# EAGLE schematic 4bit Arithmetic Unit (EAGLE 9.2.0)
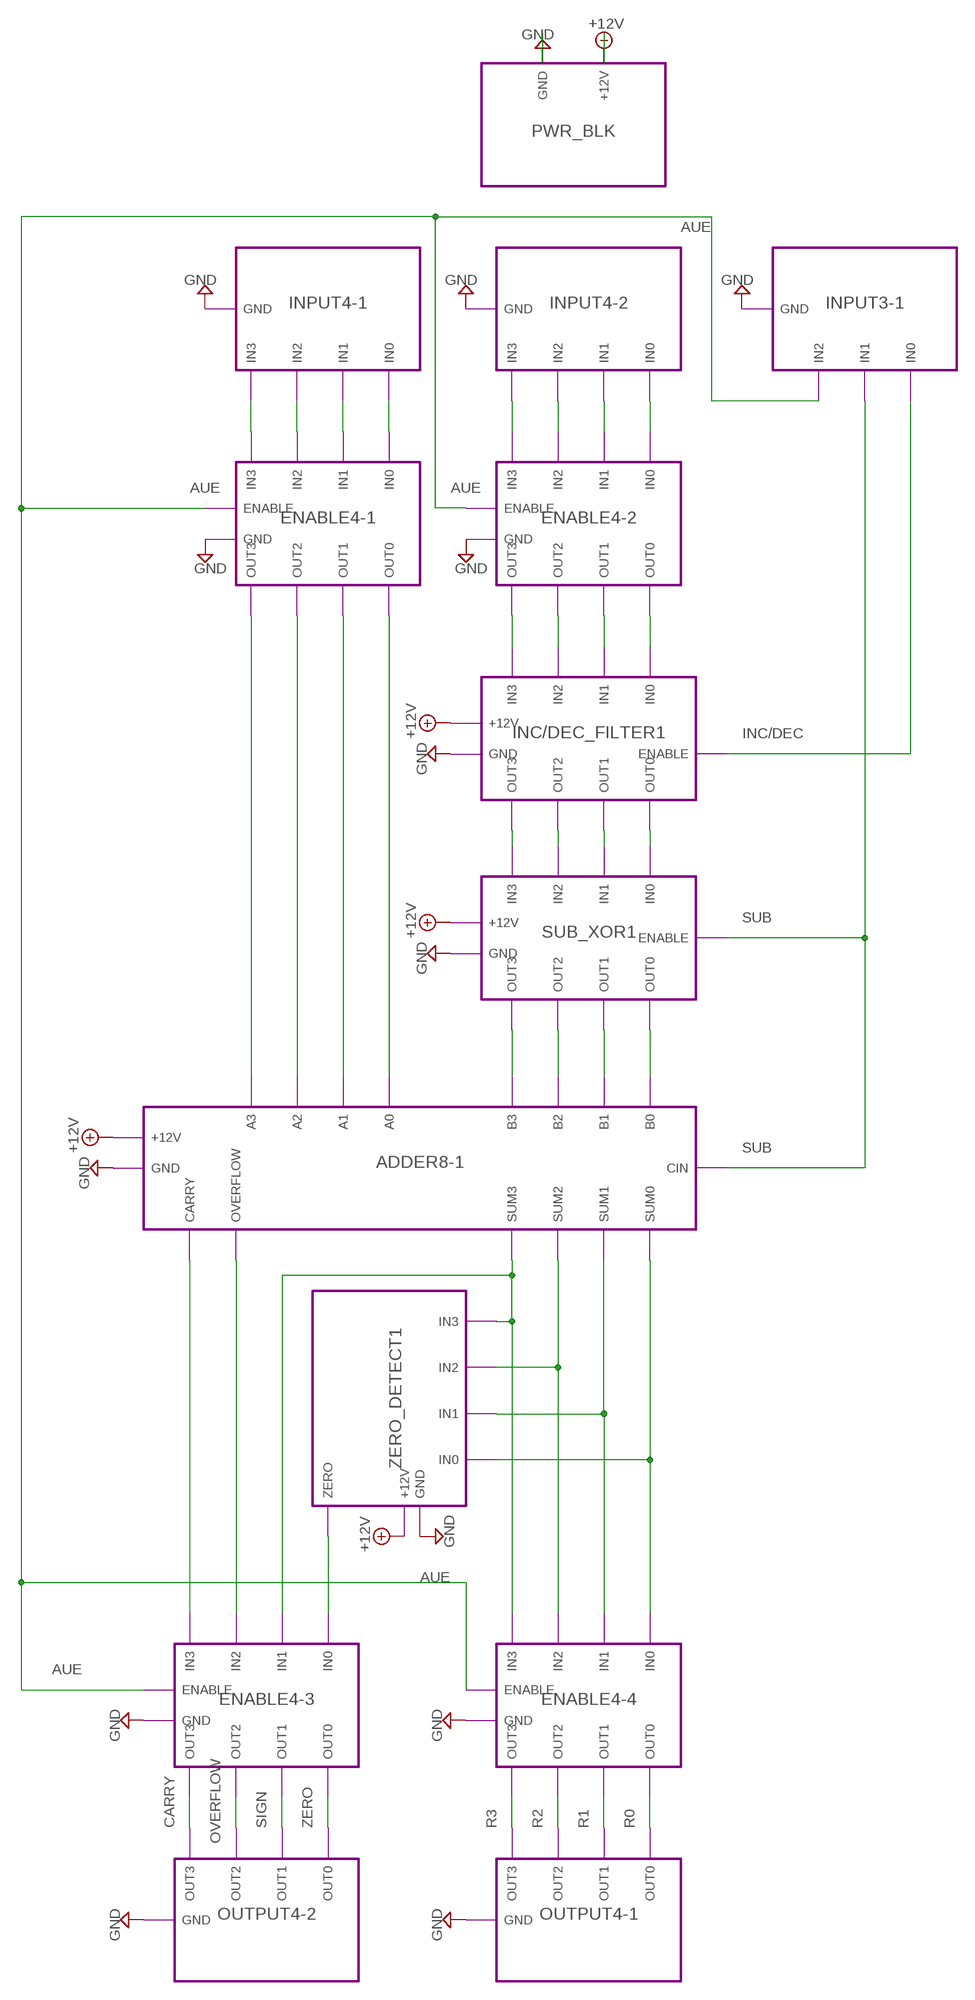
[diagram p0: schematic, sheet 1]

## Module instances
PWR_BLK = PWR_BLK
INPUT4-1 = INPUT4
INPUT4-2 = INPUT4
INPUT3-1 = INPUT3
ENABLE4-1 = ENABLE4
ENABLE4-2 = ENABLE4
INC/DEC_FILTER1 = INC/DEC_FILTER
SUB_XOR1 = SUB_XOR
ADDER8-1 = ADDER8
ZERO_DETECT1 = ZERO_DETECT
OUTPUT4-1 = OUTPUT4
OUTPUT4-2 = OUTPUT4
ENABLE4-3 = ENABLE4
ENABLE4-4 = ENABLE4

## Nets
+12V: port PWR_BLK.+12V INC/DEC_FILTER1.+12V SUB_XOR1.+12V ADDER8-1.+12V
AUE: port ENABLE4-2.ENABLE ENABLE4-1.ENABLE ENABLE4-3.ENABLE ENABLE4-4.ENABLE INPUT3-1.IN2
CARRY: port ENABLE4-3.OUT3 OUTPUT4-2.OUT3
GND: port PWR_BLK.GND INPUT4-1.GND INPUT4-2.GND INPUT3-1.GND ENABLE4-2.GND ENABLE4-1.GND INC/DEC_FILTER1.GND SUB_XOR1.GND ADDER8-1.GND OUTPUT4-1.GND OUTPUT4-2.GND ENABLE4-3.GND ENABLE4-4.GND
INC/DEC: port INC/DEC_FILTER1.ENABLE INPUT3-1.IN0
N$1: port INPUT4-1.IN0 ENABLE4-1.IN0
N$2: port INPUT4-1.IN1 ENABLE4-1.IN1
N$3: port INPUT4-1.IN2 ENABLE4-1.IN2
N$4: port INPUT4-1.IN3 ENABLE4-1.IN3
N$5: port INPUT4-2.IN0 ENABLE4-2.IN0
N$6: port INPUT4-2.IN1 ENABLE4-2.IN1
N$7: port INPUT4-2.IN2 ENABLE4-2.IN2
N$8: port INPUT4-2.IN3 ENABLE4-2.IN3
N$9: port ENABLE4-2.OUT3 INC/DEC_FILTER1.IN3
N$10: port ENABLE4-2.OUT2 INC/DEC_FILTER1.IN2
N$11: port ENABLE4-2.OUT1 INC/DEC_FILTER1.IN1
N$12: port ENABLE4-2.OUT0 INC/DEC_FILTER1.IN0
N$13: port ENABLE4-1.OUT0 ADDER8-1.A0
N$14: port ENABLE4-1.OUT1 ADDER8-1.A1
N$15: port ENABLE4-1.OUT2 ADDER8-1.A2
N$16: port ENABLE4-1.OUT3 ADDER8-1.A3
N$17: port INC/DEC_FILTER1.OUT0 SUB_XOR1.IN0
N$18: port INC/DEC_FILTER1.OUT1 SUB_XOR1.IN1
N$19: port INC/DEC_FILTER1.OUT2 SUB_XOR1.IN2
N$20: port INC/DEC_FILTER1.OUT3 SUB_XOR1.IN3
N$21: port SUB_XOR1.OUT3 ADDER8-1.B3
N$22: port SUB_XOR1.OUT2 ADDER8-1.B2
N$23: port SUB_XOR1.OUT1 ADDER8-1.B1
N$24: port SUB_XOR1.OUT0 ADDER8-1.B0
N$25: port ADDER8-1.CARRY ENABLE4-3.IN3
N$26: port ZERO_DETECT1.ZERO ENABLE4-3.IN0
N$40: port ADDER8-1.SUM0 ZERO_DETECT1.IN0 ENABLE4-4.IN0
N$41: port ZERO_DETECT1.IN1 ADDER8-1.SUM1 ENABLE4-4.IN1
N$42: port ADDER8-1.SUM2 ZERO_DETECT1.IN2 ENABLE4-4.IN2
N$43: port ADDER8-1.SUM3 ZERO_DETECT1.IN3 ENABLE4-3.IN1 ENABLE4-4.IN3
N$44: port ADDER8-1.OVERFLOW ENABLE4-3.IN2
OVERFLOW: port ENABLE4-3.OUT2 OUTPUT4-2.OUT2
R0: port ENABLE4-4.OUT0 OUTPUT4-1.OUT0
R1: port ENABLE4-4.OUT1 OUTPUT4-1.OUT1
R2: port ENABLE4-4.OUT2 OUTPUT4-1.OUT2
R3: port ENABLE4-4.OUT3 OUTPUT4-1.OUT3
SIGN: port ENABLE4-3.OUT1 OUTPUT4-2.OUT1
SUB: port SUB_XOR1.ENABLE ADDER8-1.CIN
ZERO: port ENABLE4-3.OUT0 OUTPUT4-2.OUT0

## Library data of the parts

## Module PWR_BLK
Ports: +12V(pwr) GND(pwr)
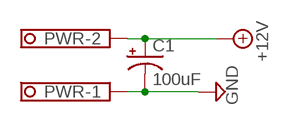
[diagram p1: schematic, module PWR_BLK, sheet 1]

### Parts
C1  100uF  100UF-POLAR-RADIAL-5MM-50V-20%  [CPOL-RADIAL-5MM-8MM]
PWR  PWR_BLK  [1751248]

### Nets
+12V: C1.1(+) PWR.2
GND: C1.2(-) PWR.1

### Library data of the parts
C1 = relay_computer_custom:100UF-POLAR: 100µF polarized capacitors A capacitor is a passive two-terminal electrical component used to store electrical energy temporarily in an electric field.; PROD_ID: ECA1HM101
PWR = relay_computer_custom:PWR_BLK: MKDS 1/ 2-3,5 Printklemme Nennstrom: 10 A Bemessungsspannung: 160 V Raster: 3,5 mm Polzahl: 2 Montageart: Löten Anschlussart: Schraubanschluss Anschlussrichtung vom Leiter zur Platine: 0° Source: http://eshop.phoenixcontact.com .. 1751248.pdf; OC_FARNELL: unknown; OC_NEWARK: unknown

## Module INPUT4
Ports: IN3(out) IN2(out) IN1(out) IN0(out) GND(pwr)
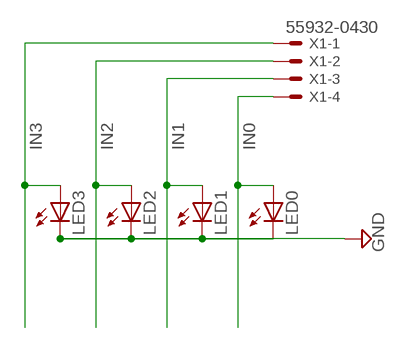
[diagram p2: schematic, module INPUT4, sheet 1]

### Parts
LED0  LED3MM  [LED3MM]
LED1  LED3MM  [LED3MM]
LED2  LED3MM  [LED3MM]
LED3  LED3MM  [LED3MM]
X1  55932-0430  [55932-0430]

### Nets
GND: LED0.K(C) LED1.K(C) LED2.K(C) LED3.K(C)
IN0: LED0.A X1.4
IN1: LED1.A X1.3
IN2: LED2.A X1.2
IN3: LED3.A X1.1

### Library data of the parts
LED0 LED1-LED3 = relay_computer_custom:LED: VCC 12V LED w/ built-in resistor
X1 = relay_computer_custom:55932-0430: 4 pin- 2.00mm Pitch MicroClasp™ Wire-to-Board Header, Single Row, Vertical, without PCB Locator Source: http://www.molex.com/pdm_docs/sd/559320430_sd.pdf

## Module INPUT3
Ports: IN0(out) IN1(out) IN2(out) GND(pwr)
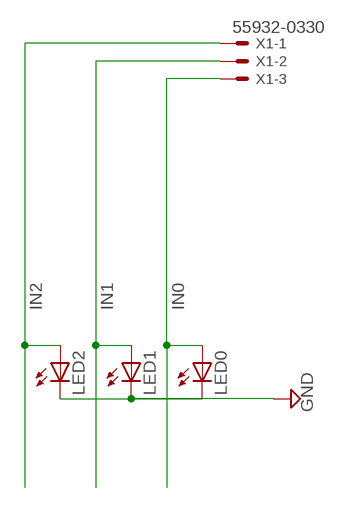
[diagram p3: schematic, module INPUT3, sheet 1]

### Parts
LED0  LED3MM  [LED3MM]
LED1  LED3MM  [LED3MM]
LED2  LED3MM  [LED3MM]
X1  55932-0330  [55932-0330]

### Nets
GND: LED0.K(C) LED1.K(C) LED2.K(C)
IN0: LED0.A X1.3
IN1: LED1.A X1.2
IN2: LED2.A X1.1

### Library data of the parts
LED0 LED1 LED2 = relay_computer_custom:LED: VCC 12V LED w/ built-in resistor
X1 = relay_computer_custom:55932-0330: 3 pin- 2.00mm Pitch MicroClasp™ Wire-to-Board Header, Single Row, Vertical, without PCB Locator Source: http://www.molex.com/pdm_docs/sd/559320330_sd.pdf

## Module ENABLE4
Ports: GND(pwr) ENABLE(in) OUT3(out) OUT2(out) OUT1(out) OUT0(out) IN3(in) IN2(in) IN1(in) IN0(in)
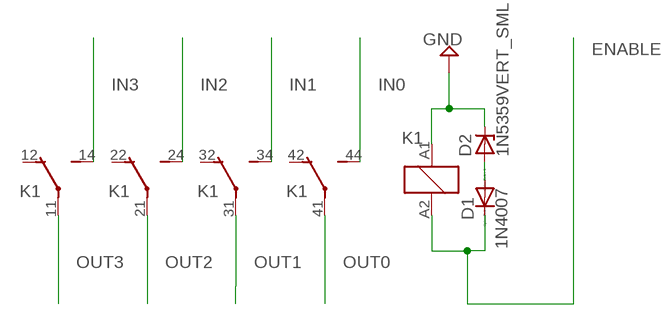
[diagram p4: schematic, module ENABLE4, sheet 1]

### Parts
D1  1N4007  [RAD2,5]
D2  1N5359VERT_SML  [RAD2.5_D2]
K1  PY14-02  [PY14-02]

### Nets
D$1: D1.A D2.A
ENABLE: D1.C K1.A2
GND: D2.C K1.A1
IN0: K1.44(5:S)
IN1: K1.34(4:S)
IN2: K1.24(3:S)
IN3: K1.14(2:S)
OUT0: K1.41(5:P)
OUT1: K1.31(4:P)
OUT2: K1.21(3:P)
OUT3: K1.11(2:P)
Unconnected: K1.12(2:O) K1.22(3:O) K1.32(4:O) K1.42(5:O)

### Library data of the parts
D1 = relay_computer_custom:1N4007: DIODE general purpose rectifier, 1 A
D2 = relay_computer_custom:1N5359: Z DIODE 24 V, 5W
K1 = relay_computer_custom:PY14-02: Miniature Relay OMRON 12VDC 4PDT 3A Relay Relay: MY4DC12 https://octopart.com/my4dc12-omron-13160135 Socket: PY14-02 https://octopart.com/py14-02-omron-113738

## Module INC/DEC_FILTER
Ports: GND(pwr) +12V(pwr) IN3(in) IN2(in) IN1(in) IN0(in) OUT0(out) OUT1(out) OUT2(out) OUT3(out) ENABLE(in)
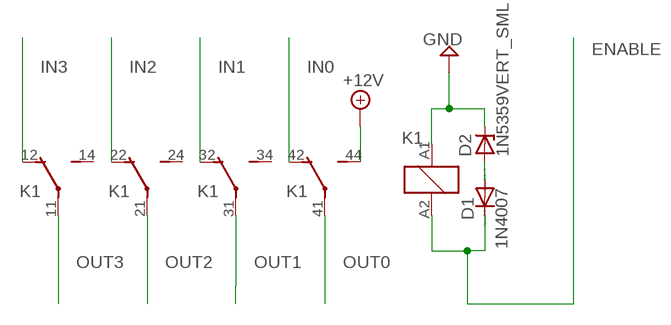
[diagram p5: schematic, module INC/DEC_FILTER, sheet 1]

### Parts
D1  1N4007  [RAD2,5]
D2  1N5359VERT_SML  [RAD2.5_D2]
K1  PY14-02  [PY14-02]

### Nets
+12V: K1.44(5:S)
D$1: D1.A D2.A
ENABLE: D1.C K1.A2
GND: D2.C K1.A1
IN0: K1.42(5:O)
IN1: K1.32(4:O)
IN2: K1.22(3:O)
IN3: K1.12(2:O)
OUT0: K1.41(5:P)
OUT1: K1.31(4:P)
OUT2: K1.21(3:P)
OUT3: K1.11(2:P)
Unconnected: K1.14(2:S) K1.24(3:S) K1.34(4:S)

### Library data of the parts
D1 = relay_computer_custom:1N4007: DIODE general purpose rectifier, 1 A
D2 = relay_computer_custom:1N5359: Z DIODE 24 V, 5W
K1 = relay_computer_custom:PY14-02: Miniature Relay OMRON 12VDC 4PDT 3A Relay Relay: MY4DC12 https://octopart.com/my4dc12-omron-13160135 Socket: PY14-02 https://octopart.com/py14-02-omron-113738

## Module SUB_XOR
Ports: +12V(pwr) GND(pwr) IN3(in) IN2(in) IN1(in) IN0(in) ENABLE(in) OUT0(out) OUT1(out) OUT2(out) OUT3(out)
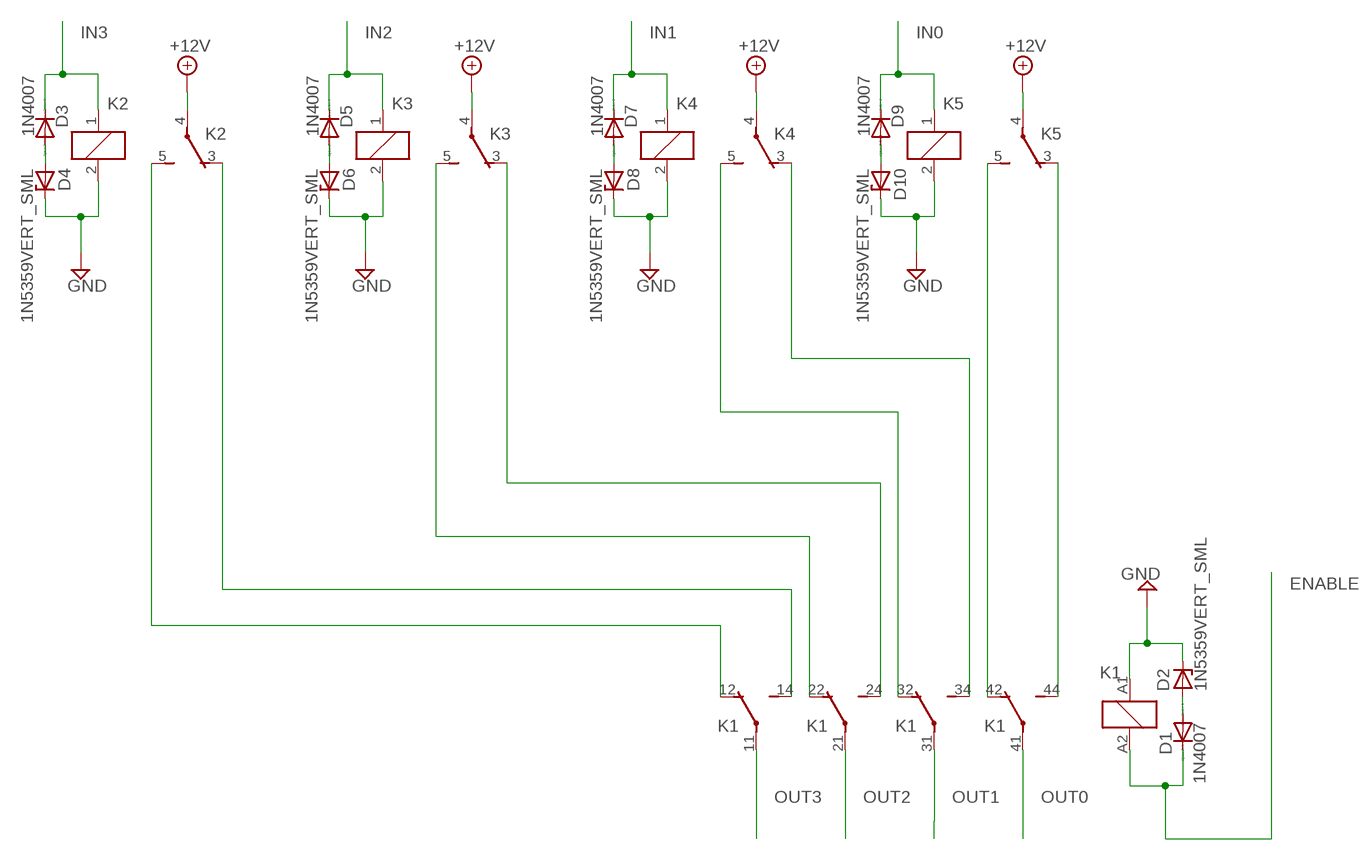
[diagram p6: schematic, module SUB_XOR, sheet 1]

### Parts
D1  1N4007  [RAD2,5]
D2  1N5359VERT_SML  [RAD2.5_D2]
D3  1N4007  [RAD2,5]
D4  1N5359VERT_SML  [RAD2.5_D2]
D5  1N4007  [RAD2,5]
D6  1N5359VERT_SML  [RAD2.5_D2]
D7  1N4007  [RAD2,5]
D8  1N5359VERT_SML  [RAD2.5_D2]
D9  1N4007  [RAD2,5]
D10  1N5359VERT_SML  [RAD2.5_D2]
K1  PY14-02  [PY14-02]
K2  HF41F-12-Z  [HF41F-12-Z]
K3  HF41F-12-Z  [HF41F-12-Z]
K4  HF41F-12-Z  [HF41F-12-Z]
K5  HF41F-12-Z  [HF41F-12-Z]

### Nets
+12V: K2.4(2:P) K3.4(2:P) K4.4(2:P) K5.4(2:P)
D$1: D1.A D2.A
D$2: D3.A D4.A
D$3: D5.A D6.A
D$4: D7.A D8.A
D$5: D9.A D10.A
ENABLE: D1.C K1.A2
GND: D2.C D4.C D6.C D8.C D10.C K1.A1 K2.2 K3.2 K4.2 K5.2
IN0: D9.C K5.1
IN1: D7.C K4.1
IN2: D5.C K3.1
IN3: D3.C K2.1
N$1: K1.42(5:O) K5.5(2:S)
N$2: K1.44(5:S) K5.3(2:O)
N$3: K1.34(4:S) K4.3(2:O)
N$4: K1.32(4:O) K4.5(2:S)
N$5: K1.24(3:S) K3.3(2:O)
N$6: K1.22(3:O) K3.5(2:S)
N$7: K1.14(2:S) K2.3(2:O)
N$8: K1.12(2:O) K2.5(2:S)
OUT0: K1.41(5:P)
OUT1: K1.31(4:P)
OUT2: K1.21(3:P)
OUT3: K1.11(2:P)

### Library data of the parts
D1 D3 D5 D7 D9 = relay_computer_custom:1N4007: DIODE general purpose rectifier, 1 A
D2 D4 D6 D8 D10 = relay_computer_custom:1N5359: Z DIODE 24 V, 5W
K1 = relay_computer_custom:PY14-02: Miniature Relay OMRON 12VDC 4PDT 3A Relay Relay: MY4DC12 https://octopart.com/my4dc12-omron-13160135 Socket: PY14-02 https://octopart.com/py14-02-omron-113738
K2-K5 = relay_computer_custom:HF41F-12-Z: SPDT RELAY Relay SPDT 5mm x 28mm HONGFA

## Module ADDER1
Ports: A(in) B(in) CIN(in) ~CIN(in) COUT(out) ~COUT(out) SUM(out) +12V(pwr) GND(pwr)
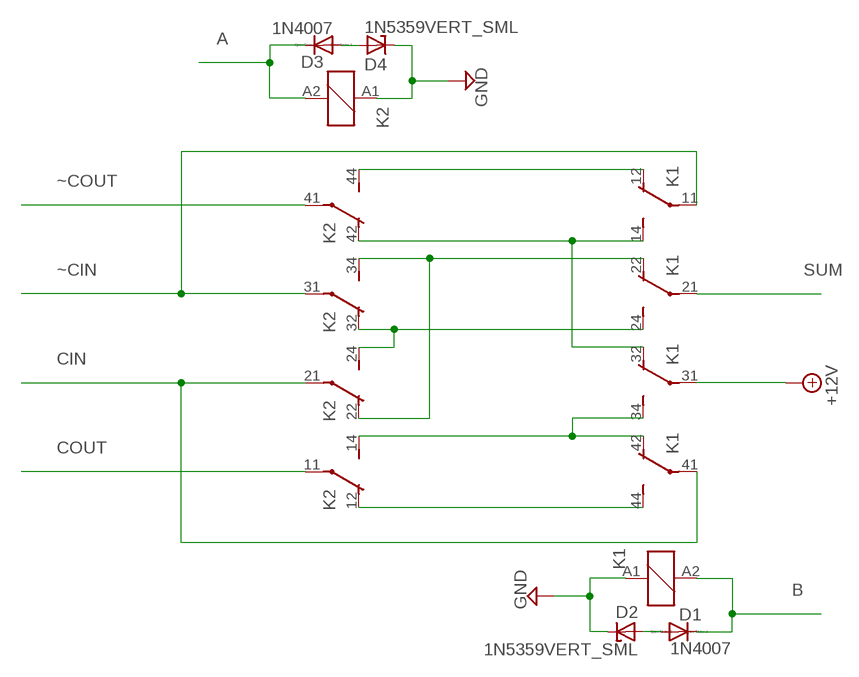
[diagram p7: schematic, module ADDER1, sheet 1]

### Parts
D1  1N4007  [RAD2,5]
D2  1N5359VERT_SML  [RAD2.5_D2]
D3  1N4007  [RAD2,5]
D4  1N5359VERT_SML  [RAD2.5_D2]
K1  PY14-02  [PY14-02]
K2  PY14-02  [PY14-02]

### Nets
+12V: K1.31(4:P)
A: D3.C K2.A2
B: D1.C K1.A2
CIN: K1.41(5:P) K2.21(3:P)
COUT: K2.11(2:P)
D$1: D1.A D2.A
D$2: D3.A D4.A
GND: D2.C D4.C K1.A1 K2.A1
N$1: K1.12(2:O) K2.44(5:S)
N$2: K1.14(2:S) K1.32(4:O) K2.42(5:O)
N$3: K1.22(3:O) K2.22(3:O) K2.34(4:S)
N$4: K1.24(3:S) K2.24(3:S) K2.32(4:O)
N$5: K1.44(5:S) K2.12(2:O)
N$6: K1.34(4:S) K1.42(5:O) K2.14(2:S)
SUM: K1.21(3:P)
~CIN: K1.11(2:P) K2.31(4:P)
~COUT: K2.41(5:P)

### Library data of the parts
D1 D3 = relay_computer_custom:1N4007: DIODE general purpose rectifier, 1 A
D2 D4 = relay_computer_custom:1N5359: Z DIODE 24 V, 5W
K1 K2 = relay_computer_custom:PY14-02: Miniature Relay OMRON 12VDC 4PDT 3A Relay Relay: MY4DC12 https://octopart.com/my4dc12-omron-13160135 Socket: PY14-02 https://octopart.com/py14-02-omron-113738

## Module ZERO_DETECT
Ports: IN3(in) IN2(in) IN1(in) IN0(in) ZERO(out) +12V(pwr) GND(pwr)
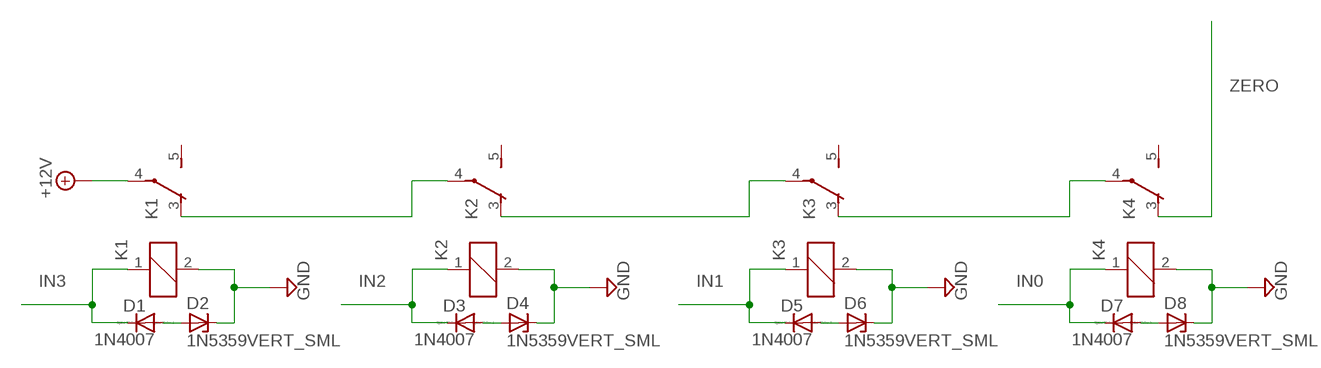
[diagram p8: schematic, module ZERO_DETECT, sheet 1]

### Parts
D1  1N4007  [RAD2,5]
D2  1N5359VERT_SML  [RAD2.5_D2]
D3  1N4007  [RAD2,5]
D4  1N5359VERT_SML  [RAD2.5_D2]
D5  1N4007  [RAD2,5]
D6  1N5359VERT_SML  [RAD2.5_D2]
D7  1N4007  [RAD2,5]
D8  1N5359VERT_SML  [RAD2.5_D2]
K1  HF41F-12-Z  [HF41F-12-Z]
K2  HF41F-12-Z  [HF41F-12-Z]
K3  HF41F-12-Z  [HF41F-12-Z]
K4  HF41F-12-Z  [HF41F-12-Z]

### Nets
+12V: K1.4(2:P)
D$1: D1.A D2.A
D$2: D3.A D4.A
D$3: D5.A D6.A
D$4: D7.A D8.A
GND: D2.C D4.C D6.C D8.C K1.2 K2.2 K3.2 K4.2
IN0: D7.C K4.1
IN1: D5.C K3.1
IN2: D3.C K2.1
IN3: D1.C K1.1
N$2: K1.3(2:O) K2.4(2:P)
N$3: K2.3(2:O) K3.4(2:P)
N$4: K3.3(2:O) K4.4(2:P)
ZERO: K4.3(2:O)
Unconnected: K1.5(2:S) K2.5(2:S) K3.5(2:S) K4.5(2:S)

### Library data of the parts
D1 D3 D5 D7 = relay_computer_custom:1N4007: DIODE general purpose rectifier, 1 A
D2 D4 D6 D8 = relay_computer_custom:1N5359: Z DIODE 24 V, 5W
K1-K4 = relay_computer_custom:HF41F-12-Z: SPDT RELAY Relay SPDT 5mm x 28mm HONGFA

## Module OUTPUT4
Ports: OUT3(in) OUT2(in) OUT1(in) OUT0(in) GND(pwr)
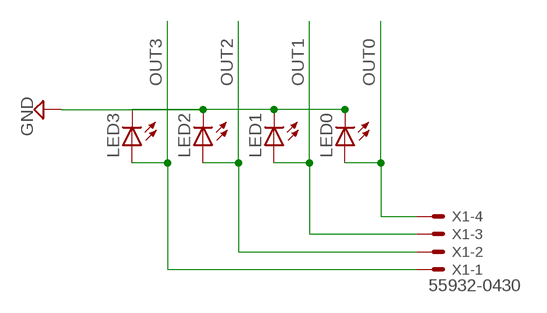
[diagram p9: schematic, module OUTPUT4, sheet 1]

### Parts
LED0  LED3MM  [LED3MM]
LED1  LED3MM  [LED3MM]
LED2  LED3MM  [LED3MM]
LED3  LED3MM  [LED3MM]
X1  55932-0430  [55932-0430]

### Nets
GND: LED0.K(C) LED1.K(C) LED2.K(C) LED3.K(C)
OUT0: LED0.A X1.4
OUT1: LED1.A X1.3
OUT2: LED2.A X1.2
OUT3: LED3.A X1.1

### Library data of the parts
LED0 LED1-LED3 = relay_computer_custom:LED: VCC 12V LED w/ built-in resistor
X1 = relay_computer_custom:55932-0430: 4 pin- 2.00mm Pitch MicroClasp™ Wire-to-Board Header, Single Row, Vertical, without PCB Locator Source: http://www.molex.com/pdm_docs/sd/559320430_sd.pdf

## Module ADDER8
Ports: A3(in) A2(in) A1(in) A0(in) B3(in) B2(in) B1(in) B0(in) CIN(in) SUM0(out) SUM1(out) SUM2(out) SUM3(out) OVERFLOW(out) CARRY(out) +12V(pwr) GND(pwr)
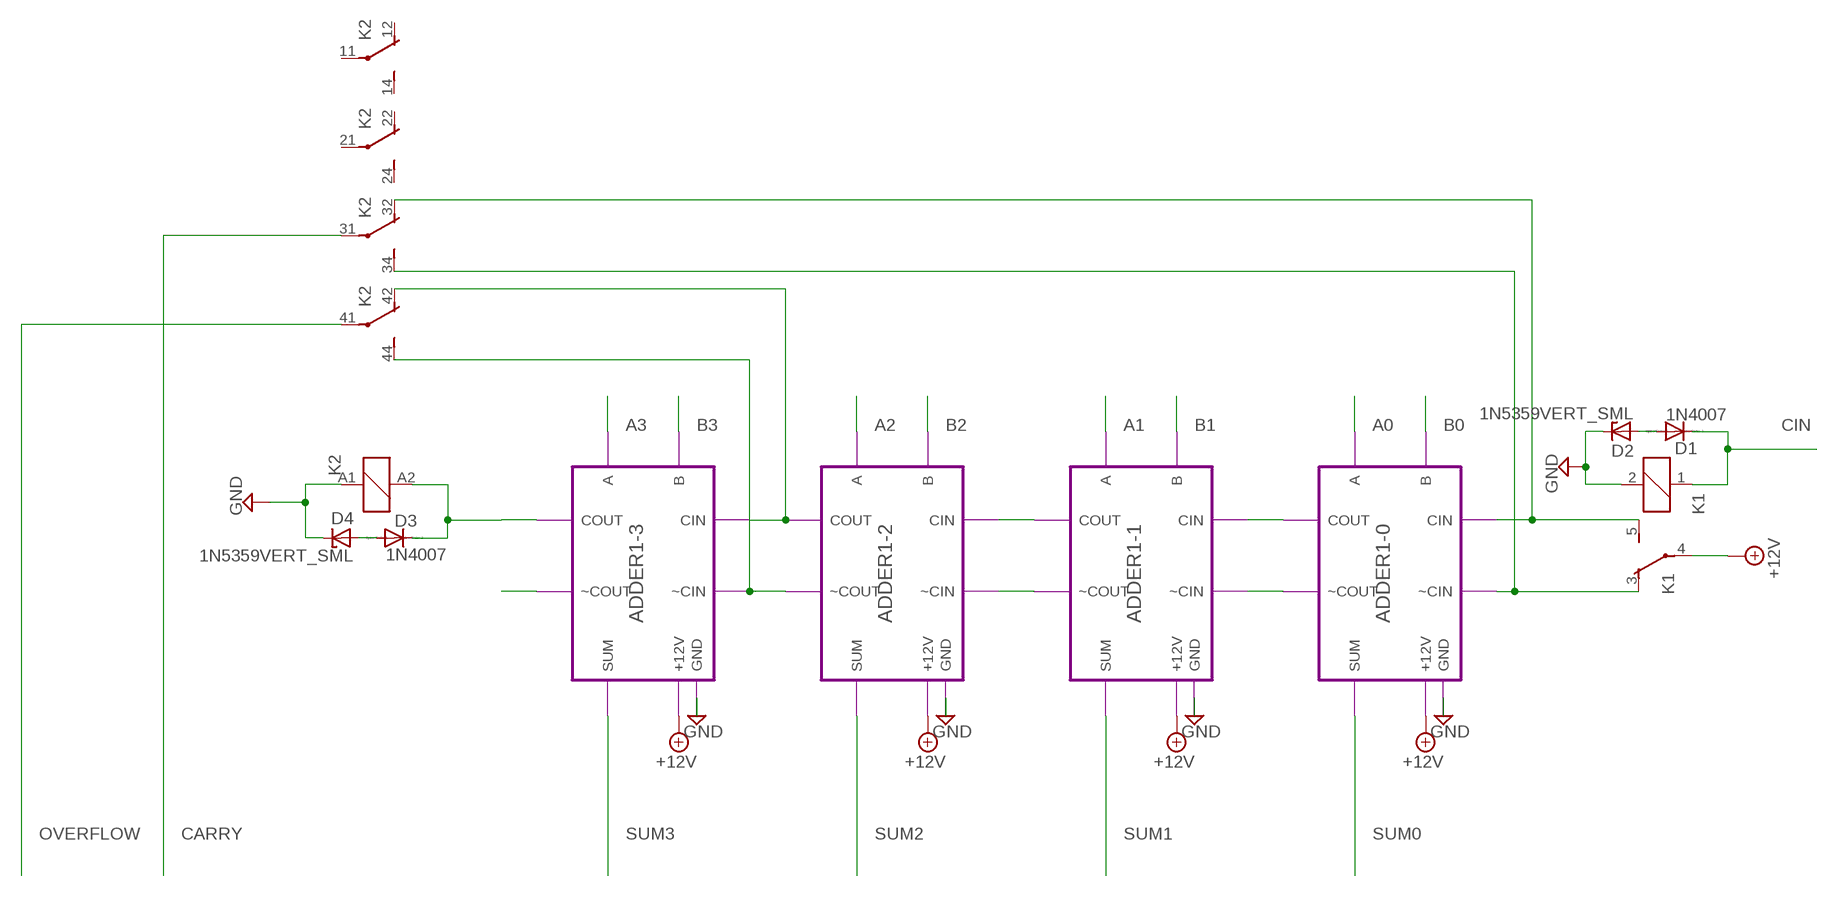
[diagram p10: schematic, module ADDER8, sheet 1]

### Parts
D1  1N4007  [RAD2,5]
D2  1N5359VERT_SML  [RAD2.5_D2]
D3  1N4007  [RAD2,5]
D4  1N5359VERT_SML  [RAD2.5_D2]
K1  HF41F-12-Z  [HF41F-12-Z]
K2  PY14-02  [PY14-02]

### Module instances
ADDER1-0 = ADDER1
ADDER1-1 = ADDER1
ADDER1-2 = ADDER1
ADDER1-3 = ADDER1

### Nets
+12V: K1.4(2:P) ; port ADDER1-0.+12V ADDER1-1.+12V ADDER1-2.+12V ADDER1-3.+12V
A0: port ADDER1-0.A
A1: port ADDER1-1.A
A2: port ADDER1-2.A
A3: port ADDER1-3.A
B0: port ADDER1-0.B
B1: port ADDER1-1.B
B2: port ADDER1-2.B
B3: port ADDER1-3.B
CARRY: K2.31(4:P)
CIN: D1.C K1.1
D$1: D1.A D2.A
D$2: D3.A D4.A
GND: D2.C D4.C K1.2 K2.A1 ; port ADDER1-0.GND ADDER1-1.GND ADDER1-2.GND ADDER1-3.GND
IN: D3.C K2.A2
IN1: K2.42(5:O) ; port ADDER1-2.COUT ADDER1-3.CIN
N$1: port ADDER1-0.COUT ADDER1-1.CIN
N$2: port ADDER1-0.~COUT ADDER1-1.~CIN
N$3: port ADDER1-1.COUT ADDER1-2.CIN
N$4: port ADDER1-1.~COUT ADDER1-2.~CIN
N$5: port ADDER1-3.COUT
N$6: K2.44(5:S) ; port ADDER1-2.~COUT ADDER1-3.~CIN
N$7: K1.3(2:O) K2.34(4:S) ; port ADDER1-0.~CIN
N$8: port ADDER1-3.~COUT
N$9: K1.5(2:S) K2.32(4:O) ; port ADDER1-0.CIN
OVERFLOW: K2.41(5:P)
SUM0: port ADDER1-0.SUM
SUM1: port ADDER1-1.SUM
SUM2: port ADDER1-2.SUM
SUM3: port ADDER1-3.SUM
Unconnected: K2.11(2:P) K2.12(2:O) K2.14(2:S) K2.21(3:P) K2.22(3:O) K2.24(3:S)

### Library data of the parts
D1 D3 = relay_computer_custom:1N4007: DIODE general purpose rectifier, 1 A
D2 D4 = relay_computer_custom:1N5359: Z DIODE 24 V, 5W
K1 = relay_computer_custom:HF41F-12-Z: SPDT RELAY Relay SPDT 5mm x 28mm HONGFA
K2 = relay_computer_custom:PY14-02: Miniature Relay OMRON 12VDC 4PDT 3A Relay Relay: MY4DC12 https://octopart.com/my4dc12-omron-13160135 Socket: PY14-02 https://octopart.com/py14-02-omron-113738

## Net classes
0 default: width 0.508 mm